# EAGLE design mother_board (EAGLE 6.2)
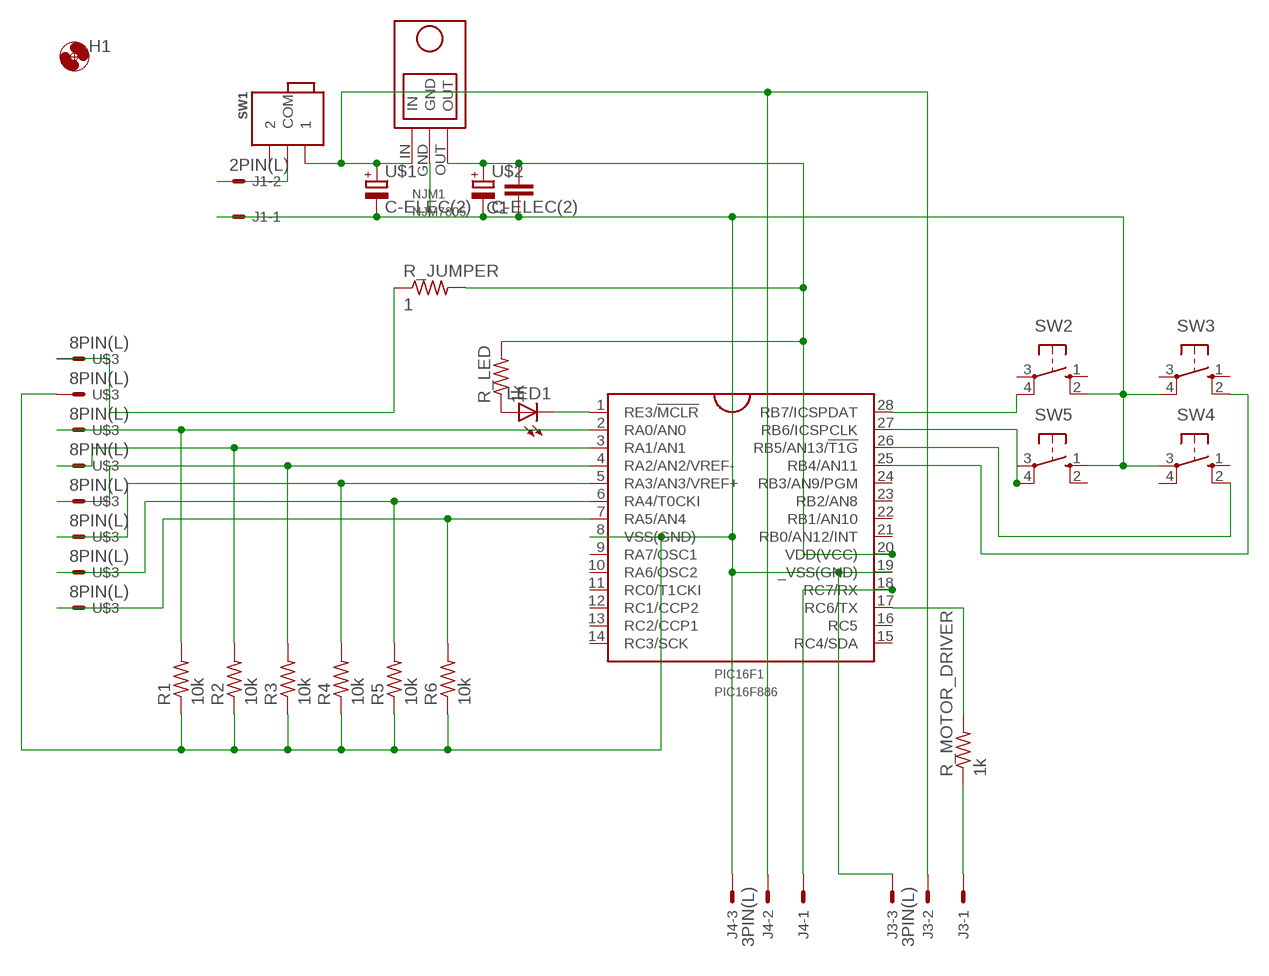
[diagram p0: schematic, sheet 1]

## Parts
C1  C-3  [C-3]
H1  HOLE3.3M3BOLT  [HOLE3.3]
J1  2PIN(L)  [2PL]
J3  3PIN(L)  [3PL]
J4  3PIN(L)  [3PL]
LED1  LED-2  [LED5MM-2]
NJM1  NJM7805  [NJM7805]
PIC16F1  PIC16F886  [DIL28-3]
R1  10k  R-  [0207/10]
R2  10k  R-  [0207/10]
R3  10k  R-  [0207/10]
R4  10k  R-  [0207/10]
R5  10k  R-  [0207/10]
R6  10k  R-  [0207/10]
R_JUMPER  1  R-  [0207/10]
R_LED  1k  R-  [0207/10]
R_MOTOR_DRIVER  1k  R-  [0207/10]
SW1  SWITCH_MININORMAL  [SWITCH_MINI]
SW2  TACTSW  [TACT]
SW3  TACTSW  [TACT]
SW4  TACTSW  [TACT]
SW5  TACTSW  [TACT]
U$1  C-ELEC(2)  [C-6MM(2)]
U$2  C-ELEC(2)  [C-6MM(2)]
U$3  8PIN(L)  [8PL]

## Nets
5V: C1.2 NJM1.OUT PIC16F1.20(VDD(VCC)) R_JUMPER.2 R_LED.2 U$2.+
9V: J1.2 J3.2 J4.2 NJM1.IN SW1.1 SW1.COM U$1.+
A0: PIC16F1.2(RA0/AN0) R1.2 U$3.P6
A1: PIC16F1.3(RA1/AN1) R2.2 U$3.P5
A2: PIC16F1.4(RA2/AN2/VREF-) R3.2 U$3.P4
A3: PIC16F1.5(RA3/AN3/VREF+) R4.2 U$3.P3
A4: PIC16F1.6(RA4/T0CKI) R5.2 U$3.P2
A5: PIC16F1.7(RA5/AN4) R6.2 U$3.P1
B4: PIC16F1.25(RB4/AN11) SW3.2(S1)
B5: PIC16F1.26(RB5/AN13/!T1G) SW4.2(S1)
B6: PIC16F1.27(RB6/ICSPCLK) SW5.4(P1)
B7: PIC16F1.28(RB7/ICSPDAT) SW2.4(P1)
GND1: C1.1 J1.1 J3.3 J4.3 NJM1.GND PIC16F1.8(VSS(GND)) PIC16F1.19(_VSS(GND)) R1.1 R2.1 R3.1 R4.1 R5.1 R6.1 SW2.2(S1) SW3.4(P1) SW4.3(P) SW5.1(S) U$1.- U$2.- U$3.P7
N$5: LED1.K(C) PIC16F1.1(RE3/!MCLR)
N$6: R_JUMPER.1 U$3.P8
N$8: PIC16F1.17(RC6/TX) R_MOTOR_DRIVER.2
N$14: LED1.A R_LED.1
SIGNAL_MOTOR_DORIVER: J3.1 R_MOTOR_DRIVER.1
SIGNAL_XBEE: J4.1 PIC16F1.18(RC7/RX)
Unconnected: PIC16F1.9(RA7/OSC1) PIC16F1.10(RA6/OSC2) PIC16F1.11(RC0/T1CKI) PIC16F1.12(RC1/CCP2) PIC16F1.13(RC2/CCP1) PIC16F1.14(RC3/SCK) PIC16F1.15(RC4/SDA) PIC16F1.16(RC5) PIC16F1.21(RB0/AN12/INT) PIC16F1.22(RB1/AN10) PIC16F1.23(RB2/AN8) PIC16F1.24(RB3/AN9/PGM) SW1.2 SW2.1(S) SW2.3(P) SW3.1(S) SW3.3(P) SW4.1(S) SW4.4(P1) SW5.2(S1) SW5.3(P)

## Library data of the parts
C1 = My_rcl:C-
H1 = FP-21T for MITS:HOLE3.3
J1 = my_connector:2PIN(L)
J3 J4 = my_connector:3PIN(L)
LED1 = my_led:LED-2
NJM1 = My_NJM7805:NJM7805
PIC16F1 = FixLib:PIC16F886
R1-R6 R_JUMPER R_LED R_MOTOR_DRIVER = My_rcl:R-: Resistor
SW1 = FP-21T for MITS:SWITCH_MINI: Switch 5.08mm
SW2-SW5 = pushsw:TACTSW
U$1 U$2 = My_rcl:C-ELEC(2)
U$3 = my_connector:8PIN(L)

## Board
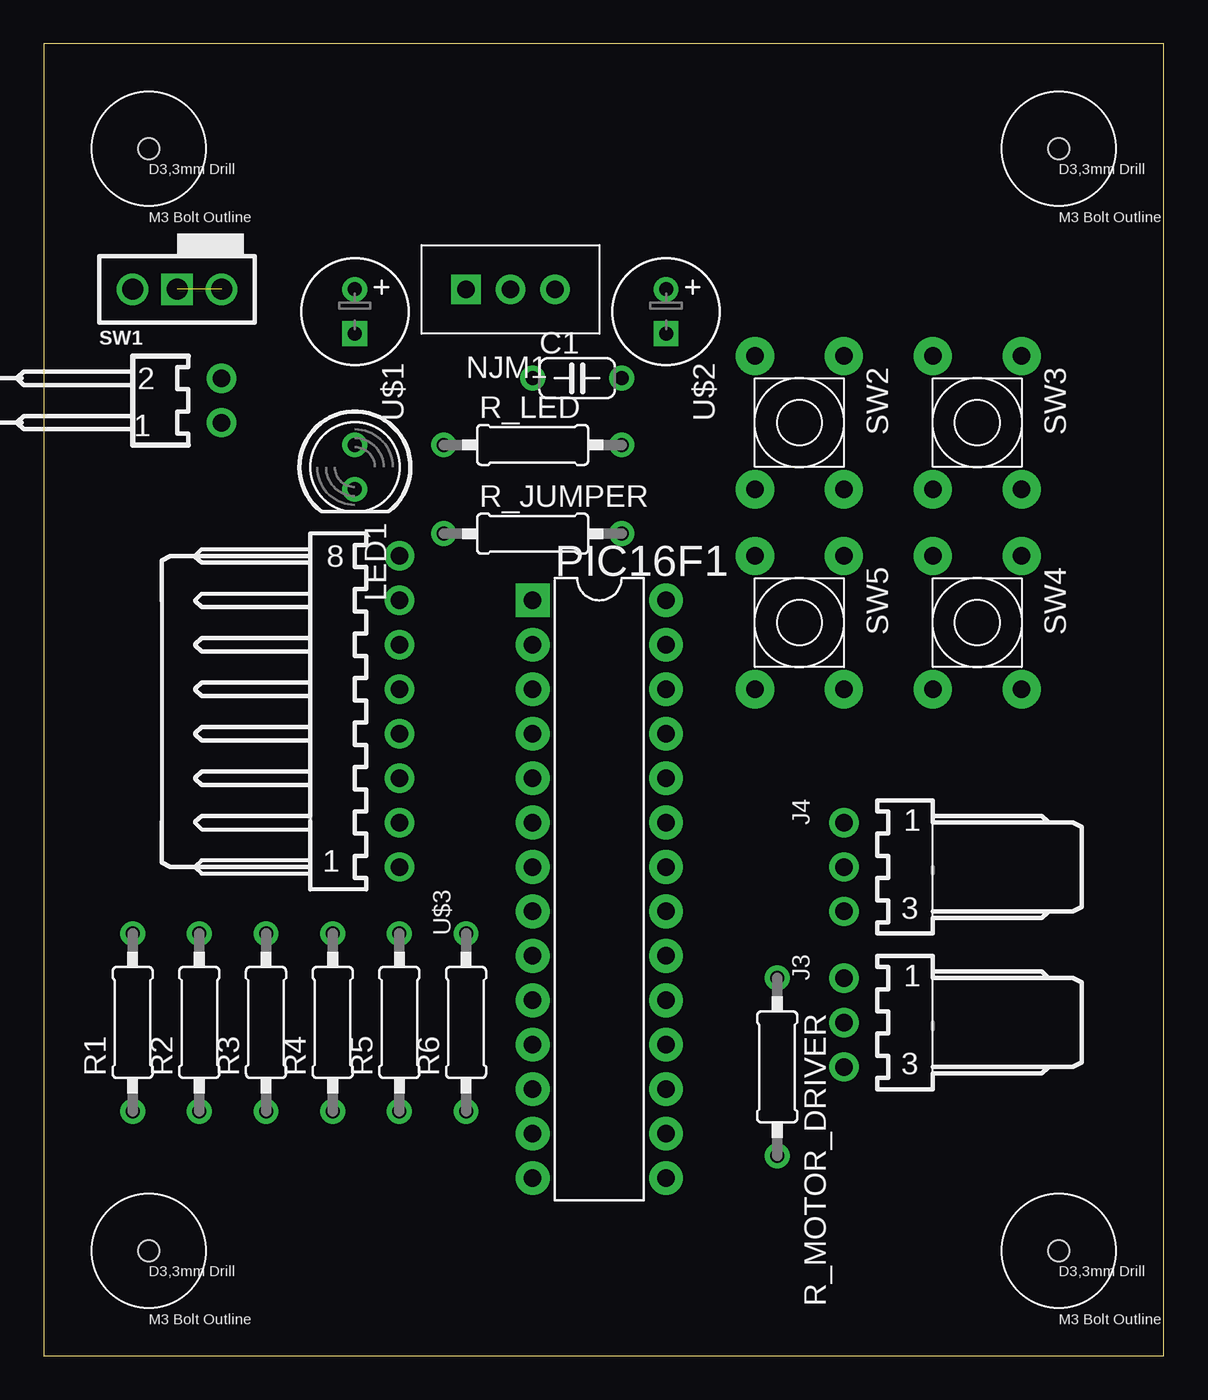
[diagram p1: board, top side]
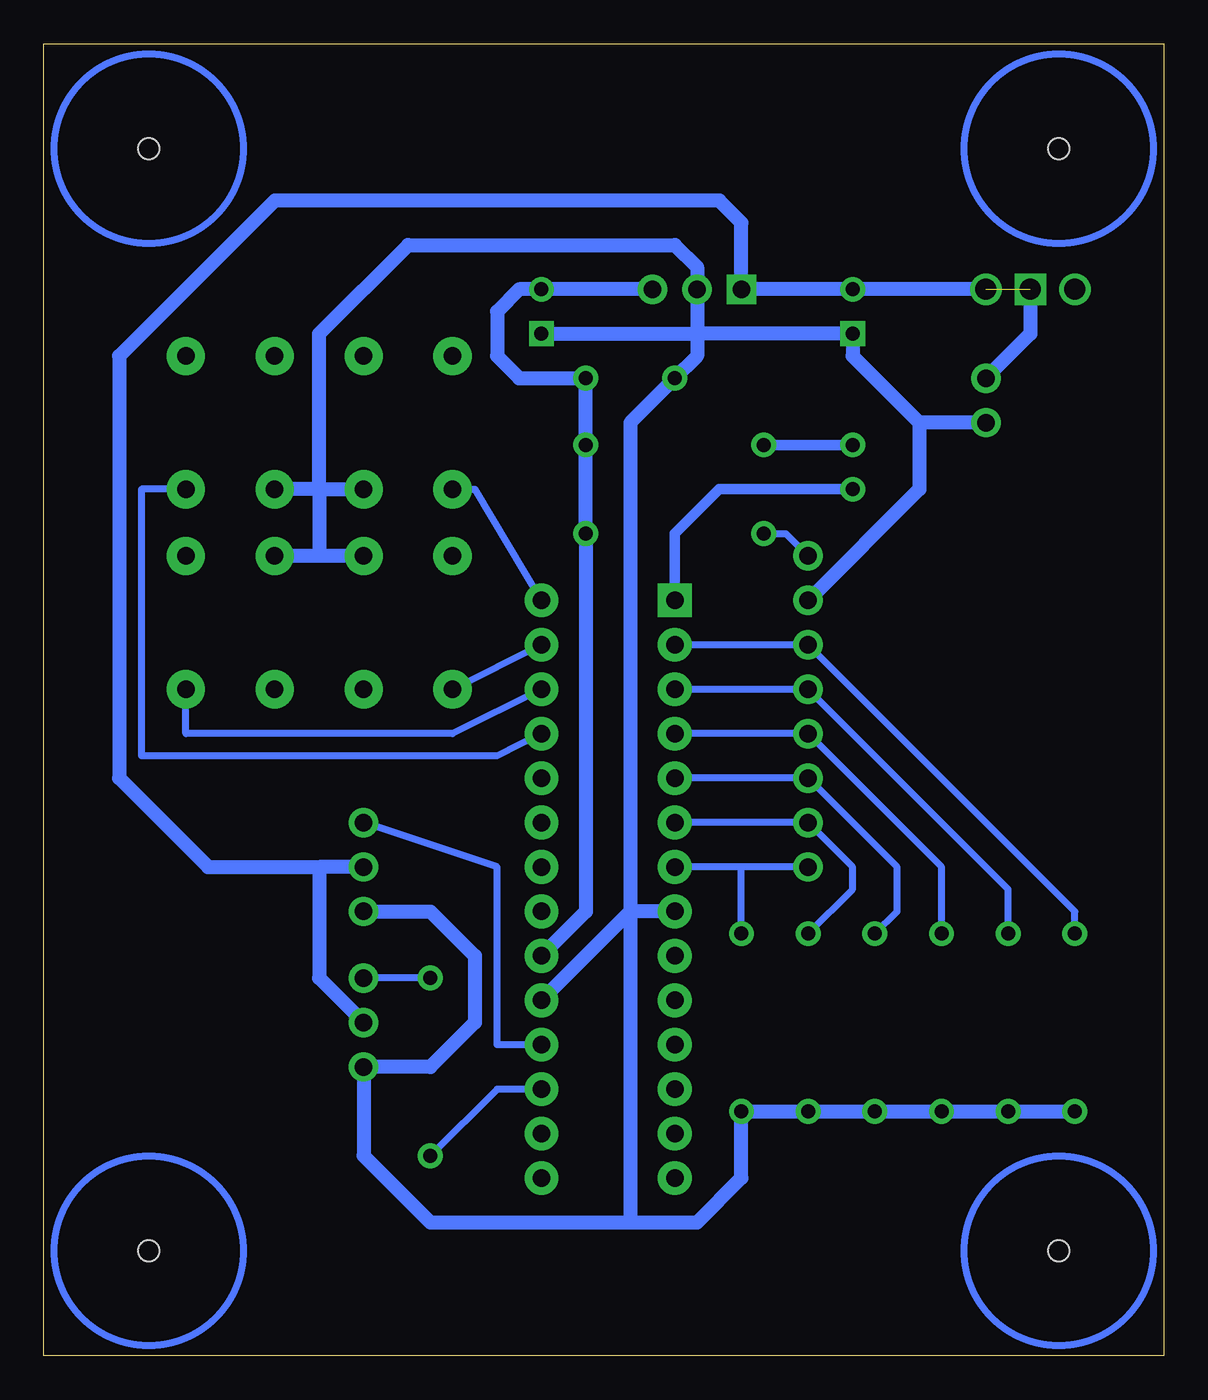
[diagram p2: board, bottom side, seen from below]

Size 64 x 75 mm. Coordinates in mm from the lower left corner, seen from the top.
Outline: 0,0 64,0 64,75 0,75 0,0
Copper layers (1*16): Top 0.035mm / dielectric 1.5mm / Bottom 0.035mm
Design rules: minimum track width 10mil, minimum drill 24mil, track to track 8mil, track to pad 8mil, pad to pad 8mil, via to via 8mil, smd to smd 8mil, copper to edge 40mil, drill to drill 8mil, minimum pad ring 10mil, minimum via ring 8mil, stop-mask expansion 4mil, vias tented up to drill 0mil, thermal gap 10mil

### Footprints (pad centres in the part's own frame; a part is rotated, then mirrored left to right if it is on the bottom)
C-3 = drill 0.8 pad 1.422: 1 -2.54,0; 2 2.54,0
HOLE3.3 = hole 1.2: 0,0
2PL = drill 1 pad 1.676: 1 -1.27,-7.62; 2 1.27,-7.62
3PL = drill 1 pad 1.676: 1 2.54,3.81; 2 0,3.81; 3 -2.54,3.81
LED5MM-2 = drill 0.8 pad 1.422: A -1.27,0; K 1.27,0
NJM7805 = drill 1 pad 1.676: GND 0,0; OUT 2.54,0 | drill 1 pad 1.676 square: IN -2.54,0
DIL28-3 = drill 1 pad 1.93 square: 1 -16.51,-3.81 | drill 1 pad 1.93: 2 -13.97,-3.81; 3 -11.43,-3.81; 4 -8.89,-3.81; 5 -6.35,-3.81; 6 -3.81,-3.81; 7 -1.27,-3.81; 8 1.27,-3.81; 9 3.81,-3.81; 10 6.35,-3.81; 11 8.89,-3.81; 12 11.43,-3.81; 13 13.97,-3.81; 14 16.51,-3.81; 15 16.51,3.81; 16 13.97,3.81; 17 11.43,3.81; 18 8.89,3.81; 19 6.35,3.81; 20 3.81,3.81; 21 1.27,3.81; 22 -1.27,3.81; 23 -3.81,3.81; 24 -6.35,3.81; 25 -8.89,3.81; 26 -11.43,3.81; 27 -13.97,3.81; 28 -16.51,3.81
0207/10 = drill 0.8 pad 1.422: 1 -5.08,0; 2 5.08,0
SWITCH_MINI = drill 1.2 pad 1.8: 1 0,2.54; 2 0,-2.54 | drill 1.2 pad 1.8 square: COM 0,0
TACT = drill 1 pad 2.184: 1 -3.81,2.54; 2 3.81,2.54; 3 -3.81,-2.54; 4 3.81,-2.54
C-6MM(2) = drill 0.8 pad 1.422: + -1.27,0 | drill 0.8 pad 1.422 square: - 1.27,0
8PL = drill 1 pad 1.676: P1 -8.89,-3.81; P2 -6.35,-3.81; P3 -3.81,-3.81; P4 -1.27,-3.81; P5 1.27,-3.81; P6 3.81,-3.81; P7 6.35,-3.81; P8 8.89,-3.81

### Placement (x,y rotation side)
C1  30.48,55.88 0 top
H1  6,6 0 top
H2  HOLE3.3M3BOLT  [HOLE3.3]  58,6 0 top
H3  HOLE3.3M3BOLT  [HOLE3.3]  58,69 0 top
H4  HOLE3.3M3BOLT  [HOLE3.3]  6,69 0 top
J1  2.54,54.61 90 top
J3  49.53,19.05 90 top
J4  49.53,27.94 90 top
LED1  17.78,50.8 270 top
NJM1  26.67,60.96 0 top
PIC16F1  31.75,26.67 270 top
R1  5.08,19.05 90 top
R2  8.89,19.05 90 top
R3  12.7,19.05 90 top
R4  16.51,19.05 90 top
R5  20.32,19.05 90 top
R6  24.13,19.05 90 top
R_JUMPER  27.94,46.99 0 top
R_LED  27.94,52.07 0 top
R_MOTOR_DRIVER  41.91,16.51 270 top
SW1  7.62,60.96 270 top
SW2  43.18,53.34 270 top
SW3  53.34,53.34 270 top
SW4  53.34,41.91 270 top
SW5  43.18,41.91 270 top
U$1  17.78,59.69 270 top
U$2  35.56,59.69 270 top
U$3  16.51,36.83 90 top

### Tracks (layer width: path | path; a pad name or v marks a point on that pad's centre or on a via)
5V
  Bottom 0.813: PIC16F1.20 33.02,25.4 R_JUMPER.2 R_LED.2 C1.2 36.83,55.88 38.1,57.15 38.1,59.69 36.83,60.96 U$2.+ NJM1.OUT
9V  (1 unrouted)
  Bottom 0.813: SW1.1 U$1.+ NJM1.IN 24.13,64.77 25.4,66.04 50.8,66.04 59.69,57.15 59.69,33.02 54.61,27.94 48.26,27.94 | J4.2 48.26,27.94 | 48.26,27.94 48.26,21.59 J3.2 | SW1.COM 7.62,58.42 J1.2
A0
  Bottom 0.406: PIC16F1.2 U$3.P6 5.08,25.4 R1.2
A1
  Bottom 0.406: PIC16F1.3 U$3.P5 8.89,26.67 R2.2
A2
  Bottom 0.406: PIC16F1.4 U$3.P4 12.7,27.94 R3.2
A3
  Bottom 0.406: PIC16F1.5 U$3.P3 15.24,27.94 15.24,25.4 R4.2
A4
  Bottom 0.406: PIC16F1.6 U$3.P2 17.78,27.94 17.78,26.67 R5.2
A5
  Bottom 0.406: U$3.P1 24.13,27.94 | 24.13,27.94 PIC16F1.7 | R6.2 24.13,27.94
B4
  Bottom 0.406: SW3.2 58.42,49.53 58.42,34.29 38.1,34.29 PIC16F1.25
B5
  Bottom 0.406: PIC16F1.26 40.64,35.56 55.88,35.56 SW4.2
B6
  Bottom 0.406: PIC16F1.27 SW5.4
B7
  Bottom 0.406: SW2.4 39.37,49.53 PIC16F1.28
GND1
  Bottom 0.813: J4.3 41.91,25.4 39.37,22.86 39.37,19.05 41.91,16.51 J3.3 45.72,11.43 41.91,7.62 30.48,7.62 | 30.48,25.4 30.48,7.62 | 30.48,25.4 PIC16F1.19 | PIC16F1.8 30.48,25.4 | 30.48,25.4 30.48,53.34 C1.1 26.67,57.15 26.67,58.42 | 30.48,7.62 26.67,7.62 24.13,10.16 R6.1 R5.1 R4.1 R3.1 R2.1 R1.1 | 26.67,58.42 U$1.- 17.78,57.15 13.97,53.34 | U$2.- 26.67,58.42 | J1.1 13.97,53.34 | 13.97,53.34 13.97,49.53 U$3.P7 | 48.26,49.53 SW3.4 | 48.26,49.53 SW2.2 | 48.26,49.53 48.26,45.72 | 48.26,45.72 SW4.3 | SW5.1 48.26,45.72 | 48.26,49.53 48.26,58.42 43.18,63.5 27.94,63.5 26.67,62.23 NJM1.GND 26.67,58.42
N$5
  Bottom 0.61: LED1.K 25.4,49.53 27.94,46.99 PIC16F1.1
N$6
  Bottom 0.406: R_JUMPER.1 21.59,46.99 U$3.P8
N$8
  Bottom 0.406: PIC16F1.17 38.1,15.24 R_MOTOR_DRIVER.2
N$14
  Bottom 0.61: R_LED.1 LED1.A
SIGNAL_MOTOR_DORIVER
  Bottom 0.406: R_MOTOR_DRIVER.1 J3.1
SIGNAL_XBEE
  Bottom 0.406: PIC16F1.18 38.1,17.78 38.1,27.94 J4.1
(copper drawn outside any net)
  shapes: Bottom circle x4